# Altium schematic sheet ESC.SchDoc (part 3 of 3)

# Altium schematic sheet ESC.SchDoc (continued)
size A2; SheetNumber (continued): <Dependency>0\outputcir_iscdiodeideal</Dependency> / <Dependency>0\dallasamp_outputcir_voh_ht4</Dependency> / <Dependency>0\dallasamp_outputcir_isinkvlimit_ht4</Dependency> / <Dependency>0\dallasamp_outputcir_vol_ht4</Dependency> / <Dependency>0\dallasamp_outputcir_rout_ht4</Dependency> / <Dependency>0\dallasamp_diodeideal_ht4</Dependency> / <Dependency>0\dallasamp_outputcir_iload_ht4</Dependency> / <Dependency>0\analog_buffer</Dependency> / <Dependency>0\dallasamp_outputcir_recoveryassist_ht4</Dependency> / <Dependency>0\hpa_or2</Dependency> / <Dependency>0\hpa_comp_ideal</Dependency> / </Model> / <Model Name="dallasamp_nondompole_ht4" Kind="CKT"> / <Text>.subckt DALLASAMP_NONDOMPOLE_HT4 VIN VOUT / XI23 NET4 VIN ANALOG_BUFFER / C1 VOUT 0 1.035E-12 / R1 VOUT NET4 1 / .ends DALLASAMP_NONDOMPOLE_HT4</Text> / <Dependency>0\analog_buffer</Dependency> / </Model> / <Model Name="dallasamp_vinrange_ht4" Kind="CKT"> / <Text>.subckt DALLASAMP_VINRANGE_HT4 VCC VEE VIN VOUT / XIDVIH NET12 NET16 DallasAmp_DiodeIdeal_HT4 / XIDVIL NET16 NET20 DallasAmp_DiodeIdeal_HT4 / R0 VIN NET16 1e-3 / V0 NET16 VOUT 0 / VIL NET20 VEE -150e-03 / VIH VCC NET12 150e-03 / .ends DALLASAMP_VINRANGE_HT4</Text> / <Dependency>0\dallasamp_diodeideal_ht4</Dependency> / </Model> / <Model Name="dallasamp_dompole_ht4" Kind="CKT"> / <Text>.subckt DALLASAMP_DOMPOLE_HT4 A B / R0 B A 6.403E04 / C0 A B 9.26E-10 / .ends DALLASAMP_DOMPOLE_HT4</Text> / </Model> / <Model Name="dallasamp_recoverycircuit_ht4" Kind="CKT"> / <Text>.subckt DALLASAMP_RECOVERYCIRCUIT_HT4 A B VCC VEE / XI2 NET8 NET014 DallasAmp_DiodeIdeal_HT4 / XI3 NET014 NET9 DallasAmp_DiodeIdeal_HT4 / VBRIDGE NET014 A 0 / VPROBE A B 0 / VRECL NET9 VEE -10e-3 / VRECH VCC NET8 -10e-3 / .ends DALLASAMP_RECOVERYCIRCUIT_HT4</Text> / <Dependency>0\dallasamp_diodeideal_ht4</Dependency> / </Model> / <Model Name="dallasamp_iq_ht4" Kind="CKT"> / <Text>.subckt DallasAmp_Iq_HT4 VCCmain VEEmain PD VEE VCC / .PARAM IOFF = { 1n } / .PARAM ION_X1 = { 0.0 } / .PARAM ION_Y1 = { 1m } / .PARAM ION_X2 = { 1.6 } / .PARAM ION_Y2 = { 1m } / .PARAM ION_X3 = { 4.0 } / .PARAM ION_Y3 = { 1m } / .PARAM ION_X4 = { 6.0 } / .PARAM ION_Y4 = { 1m } / EION_SEG1 ION_SEG1 0 VALUE = { IF ( 		          V(VCC,VEE) &lt;= ION_X2, 1, 0 ) } / EION_SEG2 ION_SEG2 0 VALUE = { IF ( V(VCC,VEE) &gt; ION_X2 &amp; V(VCC,VEE) &lt;= ION_X3, 1, 0 ) } / EION_SEG3 ION_SEG3 0 VALUE = { IF ( V(VCC,VEE) &gt; ION_X3		              , 1, 0 ) } / .PARAM ION_SEG1_SLOPE = { ( ION_Y2 - ION_Y1 ) / ( ION_X2 - ION_X1 ) } / .PARAM ION_SEG1_INTCP = { ION_Y1 - ION_SEG1_SLOPE * ION_X1 } / .PARAM ION_SEG2_SLOPE = { ( ION_Y3 - ION_Y2 ) / ( ION_X3 - ION_X2 ) } / .PARAM ION_SEG2_INTCP = { ION_Y2 - ION_SEG2_SLOPE * ION_X2 } / .PARAM ION_SEG3_SLOPE = { ( ION_Y4 - ION_Y3 ) / ( ION_X4 - ION_X3 ) } / .PARAM ION_SEG3_INTCP = { ION_Y3 - ION_SEG3_SLOPE * ION_X3 } / EION ION 0 VALUE = { 	V(ION_SEG1) * ( ION_SEG1_SLOPE * V(VCC,VEE) + ION_SEG1_INTCP ) + / +			V(ION_SEG2) * ( ION_SEG2_SLOPE * V(VCC,VEE) + ION_SEG2_INTCP ) + / + 			V(ION_SEG3) * ( ION_SEG3_SLOPE * V(VCC,VEE) + ION_SEG3_INTCP ) 	} / X1 PD PDINV VCC VEE LOGIC1 0 DLSINV / VLOGIC1 LOGIC1 0 1 / G1 VCCMAIN VEEMAIN VALUE = { V(ION) * ( 1-V(PDINV) ) + IOFF * V(PDINV) } / .ends</Text> / <Dependency>0\dlsinv</Dependency> / </Model> / <Model Name="dallasamp_zin_ht4" Kind="CKT"> / <Text>.subckt DALLASAMP_ZIN_HT4 IN1 IN2 OUT1 OUT2 / R5 IN2 OUT2 100e-3 / R4 IN1 OUT1 100e-3 / C3 OUT1 OUT2 50e-15 / C2 OUT2 0 50e-15 / C1 OUT1 0 50e-15 / GR2 OUT2 0 OUT2 0 100e-12 / GR1 0 OUT1 0 OUT1 100e-12 / GR3 OUT1 OUT2 OUT1 OUT2 1e-9 / .ends DALLASAMP_ZIN_HT4</Text> / </Model> / <Model Name="dallasamp_gmitail_ht4" Kind="CKT"> / <Text>.SUBCKT DallasAmp_GmItail_HT4  Vinp Vinm Ioutp Ioutm VEE VCC PD / X1 PD PDINV VCC VEE LOGIC1 0 DLSINV / VLOGIC1 LOGIC1 0 1 / .PARAM ITAILMAX_X1 = { 3.0 } / .PARAM ITAILMAX_Y1 = { 10m } / .PARAM ITAILMAX_X2 = { 6.0 } / .PARAM ITAILMAX_Y2 = { 10m } / .PARAM ITAILMAX_SLOPE = / + { ( ITAILMAX_Y2 - ITAILMAX_Y1 ) / ( ITAILMAX_X2 - ITAILMAX_X1 ) } / .PARAM ITAILMAX_INTCP = / + { ITAILMAX_Y1 - ITAILMAX_SLOPE * ITAILMAX_X1 } / EITAILMAX ITAILMAX 0 VALUE = / + { ITAILMAX_SLOPE * V(VCC,VEE) + ITAILMAX_INTCP  } / .PARAM ITAILMIN_X1 = { 3.0 } / .PARAM ITAILMIN_Y1 = { 10m } / .PARAM ITAILMIN_X2 = { 6.0 } / .PARAM ITAILMIN_Y2 = { 10m } / .PARAM ITAILMIN_SLOPE = / + { ( ITAILMIN_Y2 - ITAILMIN_Y1 ) / ( ITAILMIN_X2 - ITAILMIN_X1 ) } / .PARAM ITAILMIN_INTCP = / + { ITAILMIN_Y1 - ITAILMIN_SLOPE * ITAILMIN_X1 } / EITAILMIN ITAILMIN 0 VALUE = / + { ITAILMIN_SLOPE * V(VCC,VEE) + ITAILMIN_INTCP  } / G1 IOUTP IOUTM VALUE = { LIMIT ( 1.562e-01 * V(VINP,VINM) * ( 1-V(PDINV) ) , -V(ITAILMIN), / + V(ITAILMAX) ) } / .ENDS</Text> / <Dependency>0\dlsinv</Dependency> / </Model> / <Model Name="hpa_inv_ideal" Kind="CKT"> / <Text>.SUBCKT HPA_INV_IDEAL 1 2 VDD VSS / E1 2 0 VALUE = { IF( V(1)&gt; (V(VDD)+V(VSS))/2, V(VSS), V(VDD) ) } / .ENDS</Text> / </Model> / <Model Name="cmrr_new" Kind="CKT"> / <Text>.SUBCKT CMRR_NEW   VI  VO VX GNDF PARAMS: CMRR = 130 FCMRR = 1.6K / .PARAM PI = 3.141592 / .PARAM RCMRR = 1 / .PARAM GCMRR = {PWR(10,-CMRR/20)/RCMRR} / .PARAM LCMRR = {RCMRR/(2*PI*FCMRR)} / G1  GNDF 1 VX GNDF {GCMRR} / R1  1 2 {RCMRR} / L1  2 GNDF {LCMRR} / EA  101 GNDF 1 GNDF 1 / GRA  101 102 VALUE = {V(101,102)/1e6} / CA  102 GNDF 1e3 / EB  1 1a VALUE = {V(102,GNDF)} / E1  VI VO 1a GNDF 1 / .ENDS</Text> / </Model> / <Model Name="dallasamp_cmrr_ht4" Kind="CKT"> / <Text>.SUBCKT DallasAmp_CMRR_HT4 A B C / .PARAM CMRR_DC 	             = -86 / .PARAM CMRR_f3dB             = 10e3 / .PARAM CMRR_f3dB_FudgeFactor = 1 / *.PARAM CMRR_f3dB_FudgeFactor = 3.4 / .PARAM CMRR       = {0-CMRR_DC} / .PARAM FCMRR	  = {CMRR_f3dB * CMRR_f3dB_FudgeFactor} / X1 A B C 0 CMRR_NEW PARAMS: CMRR = {CMRR} FCMRR = {FCMRR} / .ENDS</Text> / <Dependency>0\cmrr_new</Dependency> / </Model> / <Model Name="psrr_dual_new" Kind="CKT"> / <Text>.SUBCKT PSRR_DUAL_NEW   VDD  VSS  VI  VO  GNDF / + PARAMS: PSRRP = 130 FPSRRP = 1.6 / + PSRRN = 130 FPSRRN = 1.6 / .PARAM PI = 3.141592 / .PARAM RPSRRP = 1 / .PARAM GPSRRP = {PWR(10,-PSRRP/20)/RPSRRP} / .PARAM LPSRRP = {RPSRRP/(2*PI*FPSRRP)} / .PARAM RPSRRN = 1 / .PARAM GPSRRN = {PWR(10,-PSRRN/20)/RPSRRN} / .PARAM LPSRRN = {RPSRRN/(2*PI*FPSRRN)} / G1  GNDF 1 VDD GNDF {GPSRRP} / R1  1 2 {RPSRRP} / L1  2 GNDF {LPSRRP} / EA  101 GNDF 1 GNDF 1 / GRA  101 102 VALUE = { V(101,102)/1e6 } / CA  102 GNDF 1e3 / EB  1 1a VALUE = {V(102,GNDF)} / G2  GNDF 3 VSS GNDF {GPSRRN} / R2  3 4 {RPSRRN} / L2  4 GNDF {LPSRRN} / EC  301 GNDF 3 GNDF 1 / GRC  301 302 VALUE = { V(301,302)/1e6 } / CC  302 GNDF 1e3 / ED  3 3a VALUE = {V(302,GNDF)} / E1  VO VI VALUE = {V(1a,GNDF) + V(3a,GNDF)} / C3  VDD VSS 10P / .ENDS</Text> / </Model> / <Model Name="dallasamp_psrr_ht4" Kind="CKT"> / <Text>.SUBCKT DallasAmp_PSRR_HT4 VDD VSS A B / .PARAM PSRRP_DC    = -100 / .PARAM PSRRP_f3dB  = 100k / .PARAM PSRRN_DC    = -90 / .PARAM PSRRN_f3dB  = 90k / .PARAM PSRRP       = {0-PSRRP_DC} / .PARAM PSRRN       = {0-PSRRN_DC} / .PARAM FPSRRP      = {PSRRP_f3dB} / .PARAM FPSRRN      = {PSRRN_f3dB} / X1 VDD VSS A B 0 PSRR_DUAL_NEW PARAMS: / + PSRRP = {PSRRP} FPSRRP = {FPSRRP} / + PSRRN = {PSRRN} FPSRRN = {FPSRRN} / .ENDS</Text> / <Dependency>0\psrr_dual_new</Dependency> / </Model> / <Model Name="femt" Kind="CKT"> / <Text>.SUBCKT FEMT  1 2 PARAMS: NLFF = 0.1 FLWF = 0.001 NVRF = 0.1 / .PARAM GLFF={PWR(FLWF,0.25)*NLFF/1164} / .PARAM RNVF={1.184*PWR(NVRF,2)} / .MODEL DVNF D KF={PWR(FLWF,0.5)/1E11} IS=1.0E-16 / I1 0 7 10E-3 / I2 0 8 10E-3 / D1 7 0 DVNF / D2 8 0 DVNF / E1 3 6 7 8 {GLFF} / R1 3 0 1E9 / R2 3 0 1E9 / R3 3 6 1E9 / E2 6 4 5 0 10 / R4 5 0 {RNVF} / R5 5 0 {RNVF} / R6 3 4 1E9 / R7 4 0 1E9 / G1 1 2 3 4 1E-6 / C1 1 0 1E-15 / C2 2 0 1E-15 / C3 1 2 1E-15 / .ENDS</Text> / </Model> / <Model Name="dallasamp_inoise_ht4" Kind="CKT"> / <Text>.SUBCKT DallasAmp_Inoise_HT4 A B / .PARAM X = { 1m  } / .PARAM Y = { 100 } / .PARAM Z = { 1 } / X1 A B FEMT PARAMS: NLFF = { Y }  FLWF = { X } NVRF = { Z } / .ENDS</Text> / <Dependency>0\femt</Dependency> / </Model> / <Model Name="vnse" Kind="CKT"> / <Text>.SUBCKT VNSE  1 2 PARAMS: NLF = 10 FLW = 4  NVR = 4.6 / .PARAM GLF={PWR(FLW,0.25)*NLF/1164} / .PARAM RNV={1.184*PWR(NVR,2)} / .MODEL DVN D KF={PWR(FLW,0.5)/1E11} IS=1.0E-16 / I1 0 7 10E-3 / I2 0 8 10E-3 / D1 7 0 DVN / D2 8 0 DVN / E1 3 6 7 8 {GLF} / R1 3 0 1E9 / R2 3 0 1E9 / R3 3 6 1E9 / E2 6 4 5 0 10 / R4 5 0 {RNV} / R5 5 0 {RNV} / R6 3 4 1E9 / R7 4 0 1E9 / E3 1 2 3 4 1 / C1 1 0 1E-15 / C2 2 0 1E-15 / C3 1 2 1E-15 / .ENDS</Text> / </Model> / <Model Name="dallasamp_vnoise_ht4" Kind="CKT"> / <Text>.SUBCKT DallasAmp_Vnoise_HT4 A B / .PARAM X = { 1m  } / .PARAM Y = { 100 } / .PARAM Z = { 5  } / X1 A B VNSE PARAMS: NLF = { Y } FLW = { X }  NVR = { Z } / .ENDS</Text> / <Dependency>0\vnse</Dependency> / </Model> / <Model Name="vinoffset" Kind="CKT"> / <Text>.SUBCKT Vinoffset POS NEG PARAMS: / + TA     = 25 / + VOS    = 500u / + DRIFT  = 10u / E1 POS NEG VALUE = { DRIFT * TEMP + ( VOS - DRIFT * TA ) } / .ENDS</Text> / </Model> / <Model Name="dallasamp_ht4" Kind="CKT"> / <Text>.subckt DALLASAMP_HT4 VEE VCC VINM VINP VOUT PD / XI13 VEE_INT VEE ANALOG_BUFFER / XI12 VCC_INT VCC ANALOG_BUFFER / XI58 HIGHZ NET32 DALLASAMP_DOMPOLE_HT4 / XI28 NET41 NET51 VCC_INT VEE_INT DALLASAMP_RECOVERYCIRCUIT_HT4 / XI26 NET51 NET61 DALLASAMP_NONDOMPOLE_HT4 / XI30 POWER VCC_INT VCC VEE_INT VEE NET61 VOUT DALLASAMP_OUTPUTCIR_HT4 / IBIASP VINP_INT 0 100.5e-6 / IBIASM VINM_INT 0 99.5e-6 / XI56 VCC_INT VEE_INT NET22 VINM_INT DALLASAMP_VINRANGE_HT4 / XI54 VCC_INT VEE_INT NET21 VINP_INT DALLASAMP_VINRANGE_HT4 / XI53 VINP VINM NET1 NET2 DALLASAMP_ZIN_HT4 / XI40 VCC VEE POWER VEE_INT VCC_INT DallasAmp_Iq_HT4 / XI52 VINP_INT VINM_INT NET32 NET31 VEE_INT VCC_INT POWER DallasAmp_GmItail_HT4 / XAHDLINV3 PD PDINV VCC_INT VEE_INT HPA_INV_IDEAL / XAHDLINV1 PDINV POWER VCC_INT VEE_INT HPA_INV_IDEAL / XI21 NET12 NET22 NET12 DallasAmp_CMRR_HT4 / XI19 VCC_INT VEE_INT NET2 NET12 DallasAmp_PSRR_HT4 / XI18 NET11 NET2 DallasAmp_Inoise_HT4 / XI17 NET1 NET11 DallasAmp_Vnoise_HT4 / R14 VCC_INT PD 10e6 / *VINOFFSET NET21 NET11 4.00e-03 / XVINOFFSET NET21 NET11 Vinoffset PARAMS: TA=25 VOS=4.00e-03 DRIFT=10e-6 / VPROBE1 NET31 HIGHZ / VDOMPOLEBIAS NET32 0 0 / VPROBE2 HIGHZ NET41 / .ends DALLASAMP_HT4</Text> / <Dependency>0\dallasamp_outputcir_ht4</Dependency> / <Dependency>0\dallasamp_nondompole_ht4</Dependency> / <Dependency>0\analog_buffer</Dependency> / <Dependency>0\dallasamp_vinrange_ht4</Dependency> / <Dependency>0\dallasamp_dompole_ht4</Dependency> / <Dependency>0\dallasamp_recoverycircuit_ht4</Dependency> / <Dependency>0\dallasamp_iq_ht4</Dependency> / <Dependency>0\dallasamp_zin_ht4</Dependency> / <Dependency>0\dallasamp_gmitail_ht4</Dependency> / <Dependency>0\hpa_inv_ideal</Dependency> / <Dependency>0\dallasamp_cmrr_ht4</Dependency> / <Dependency>0\dallasamp_psrr_ht4</Dependency> / <Dependency>0\dallasamp_inoise_ht4</Dependency> / <Dependency>0\dallasamp_vnoise_ht4</Dependency> / <Dependency>0\vinoffset</Dependency> / </Model> / <Model Name="drv8301" Kind="CKT"> / <Text>.subckt DRV8301 AGND AVDD VINM VINP VOUT / XI0 AGND AVDD VINM VINP VOUT PD DALLASAMP_HT4 / VPD AVDD PD 0 / .ends DRV8301</Text> / <Dependency>0\dallasamp_ht4</Dependency> / </Model> / </CacheFrame> / <CacheFrame Number="1"> / <Model Name="and2_basic_gen" Kind="CKT"> / <Text>*$ / .SUBCKT AND2_BASIC_GEN A B Y PARAMS: VDD=1 VSS=0 VTHRESH=0.5 / $CDNENCSTART_ADV2 / 17f62b1fb318c25603aeb85644ae98a5d179ef807807791f6459efacb9d7ffc37a831b146dc0f06bb1ef275619162e6d8f7ad0dc708bf15ae1a1d5bd0ae623b2 / 86cf27ea17897a8cb60df20d05c273fb463c60c76d6334b75e98d0c9903dbd1ecfc0e08f63319350a0d2430850129986dff8dba9cdb764afe6b55a7105d51a71 / 0242b14f7642c07a6d9287a63f6461352391fe406c6a9c4085f8c2cbc54e9cb41d6c66e497028004a07d0f821750426c9d08104ef29d51d519a2f240b668e378 / 0b1b023dc81c8cdaa7d8f234b53a8b39ea1af96ea6d6f635f68326cabbe00c0582efc3103447d6c6b2120f40908dbf452c257e0a60c0cb32dcc1fc097092974a / f4a0ccfc221f4350afb7bd0e1ee5b3e3b70c4285467156eeef951a190d9667302310153a23532af982540dd23c06ecb988541f163696fafdd3b10b26b5350bb0 / $CDNENCFINISH_ADV2 / .ENDS AND2_BASIC_GEN</Text> / </Model> / <Model Name="comphys_basic_gen" Kind="CKT"> / <Text>*$ / .SUBCKT COMPHYS_BASIC_GEN INP INM HYS OUT PARAMS: VDD=1 VSS=0 VTHRESH=0.5 / $CDNENCSTART_ADV2 / 17f62b1fb318c25603aeb85644ae98a5d179ef807807791f6459efacb9d7ffc37a831b146dc0f06bb1ef275619162e6d8f7ad0dc708bf15ae1a1d5bd0ae623b2 / 00b53bbe8aae8852330f25271bb63ecb452f6be533f052ee67be30628730681a13f044dd88b365416669eca870fc8051764ee52247de91cdf5aa26f485295593 / 3e3f3e87086a35502de552f1ad36fdf5bf8222e25b990f2da798a9a0a112ff9bb92ed6f3db7fa99fa26abaf945e35c2d412b761f12c297f5efc8392584f55ebe / 454a7b940f4bb638243842aeebba109a8e2e962c97ddc20b67358915b778ac64130ecf4cc706742a6f2e1f35c49e2d86f67a62546841f85d99530ec55b3108f8 / 618bf9559b884c783dff91d3e2bf7ec8c31bf63f60850221a7ac1e46b19d611a14ce99fe5fc488c292605a68529c58a741df5705408475625a9630c1a16a85bd / b20ca1c170870dc7dae626dcd13a6492ba4a2336c155842202ef4231ea29571c6165ae46f7df2f50aa28a839a9663dcf612ed07829bc9d7912fd290065bfc094 / 2f77ff083073b88efd1f7f431862ebf4563efeb4711097ae753a42feaed9de84876afd92a80bee00a2113155d96b93d68848804a173641721f71a1af57dd2c20 / $CDNENCFINISH_ADV2 / .ENDS COMPHYS_BASIC_GEN</Text> / </Model> / <Model Name="inv_basic_gen" Kind="CKT"> / <Text>.SUBCKT INV_BASIC_GEN A  Y PARAMS: VDD=1 VSS=0 VTHRESH=0.5 / $CDNENCSTART_ADV2 / 17f62b1fb318c25603aeb85644ae98a5d179ef807807791f6459efacb9d7ffc37a831b146dc0f06bb1ef275619162e6d8f7ad0dc708bf15ae1a1d5bd0ae623b2 / 86cf27ea17897a8cb60df20d05c273fb463c60c76d6334b75e98d0c9903dbd1ecfc0e08f63319350a0d2430850129986b9dbfa59b51add982529e38ae20cb170 / 17aa90e4a67664d4f9eaeca2cb7e984d1b42e2318efa134cf42b00e9e24fcdd0cdddf84886c0fd8c2a5c0e1b2ba152f34969c107ff1b81b484f51bbed89c9c89 / 0b1b023dc81c8cdaa7d8f234b53a8b39ea1af96ea6d6f635f68326cabbe00c0582efc3103447d6c6b2120f40908dbf452c257e0a60c0cb32dcc1fc097092974a / f4a0ccfc221f4350afb7bd0e1ee5b3e3b70c4285467156eeef951a190d9667302310153a23532af982540dd23c06ecb988541f163696fafdd3b10b26b5350bb0 / $CDNENCFINISH_ADV2 / .ENDS INV_BASIC_GEN</Text> / </Model> / </CacheFrame> / </root>
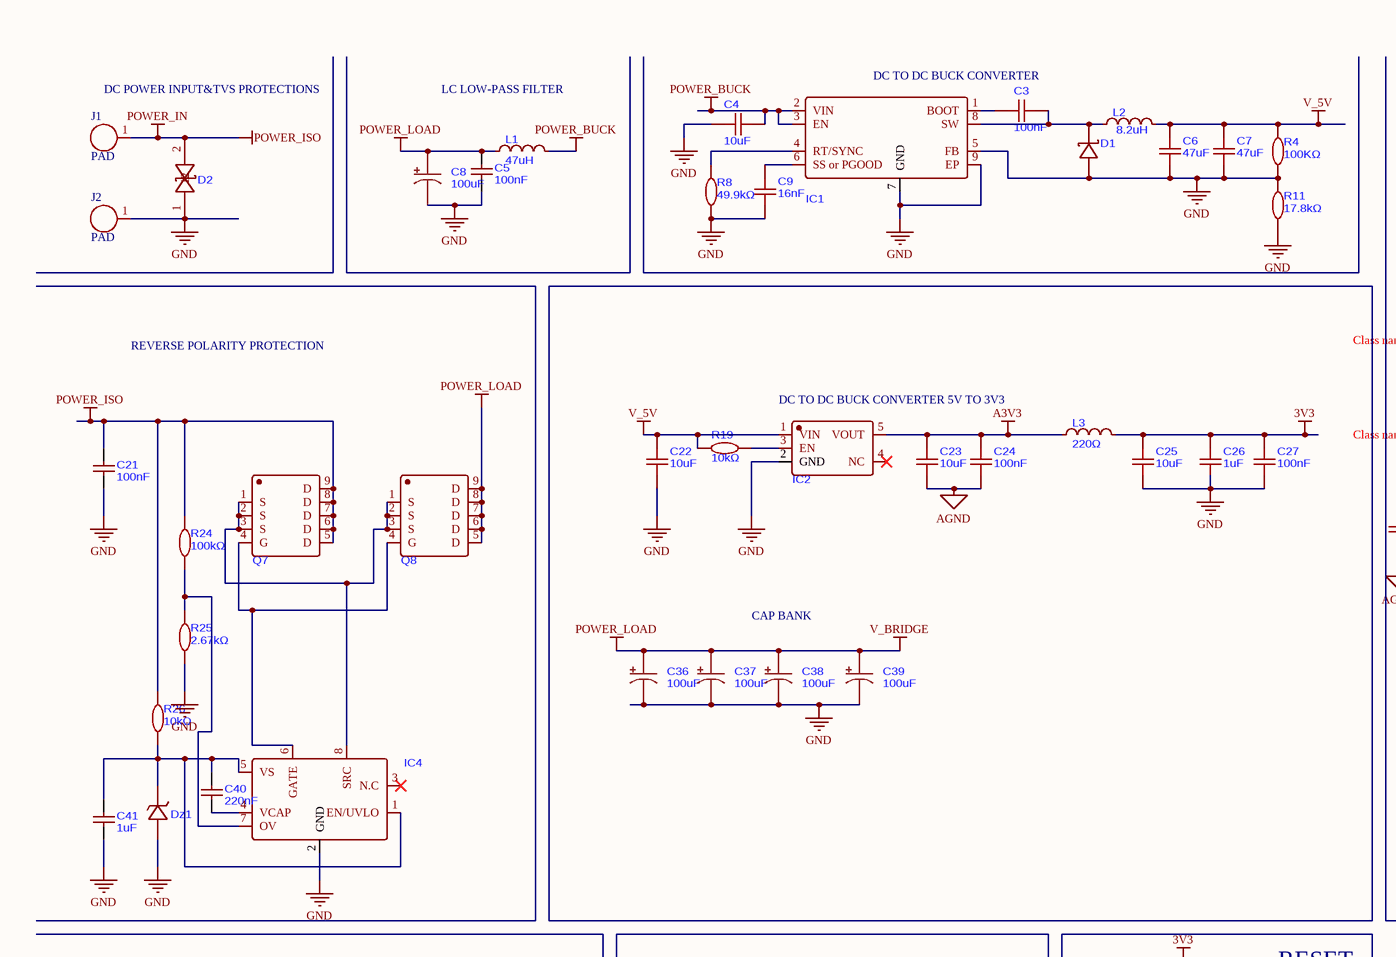
[diagram p0: ESC.SchDoc, top left]
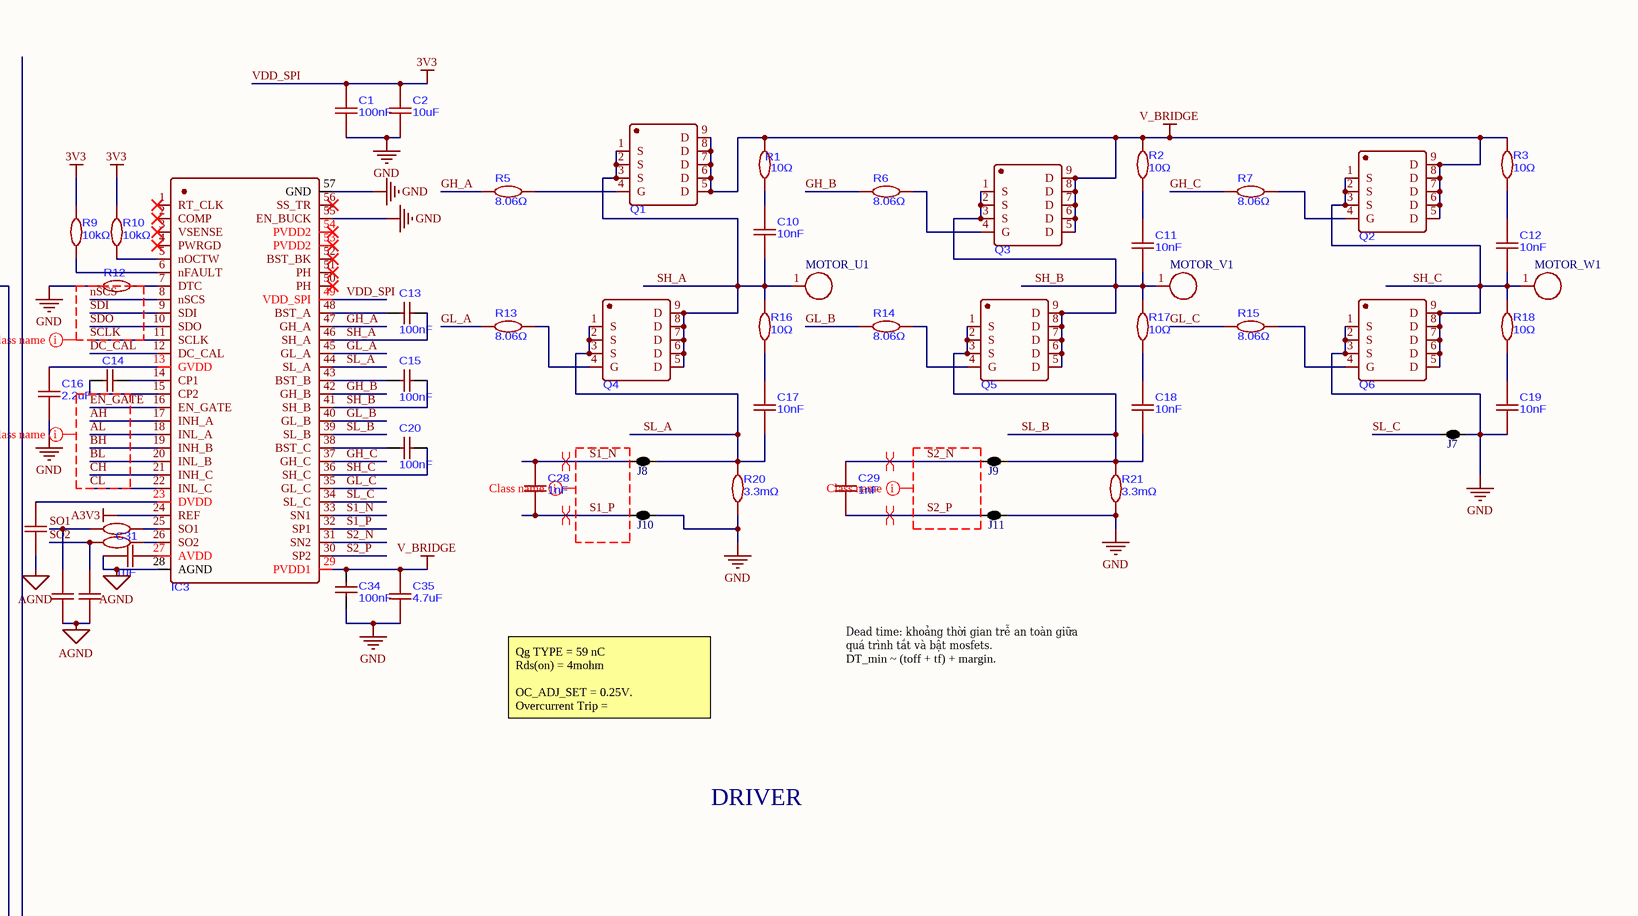
[diagram p1: ESC.SchDoc, top right]
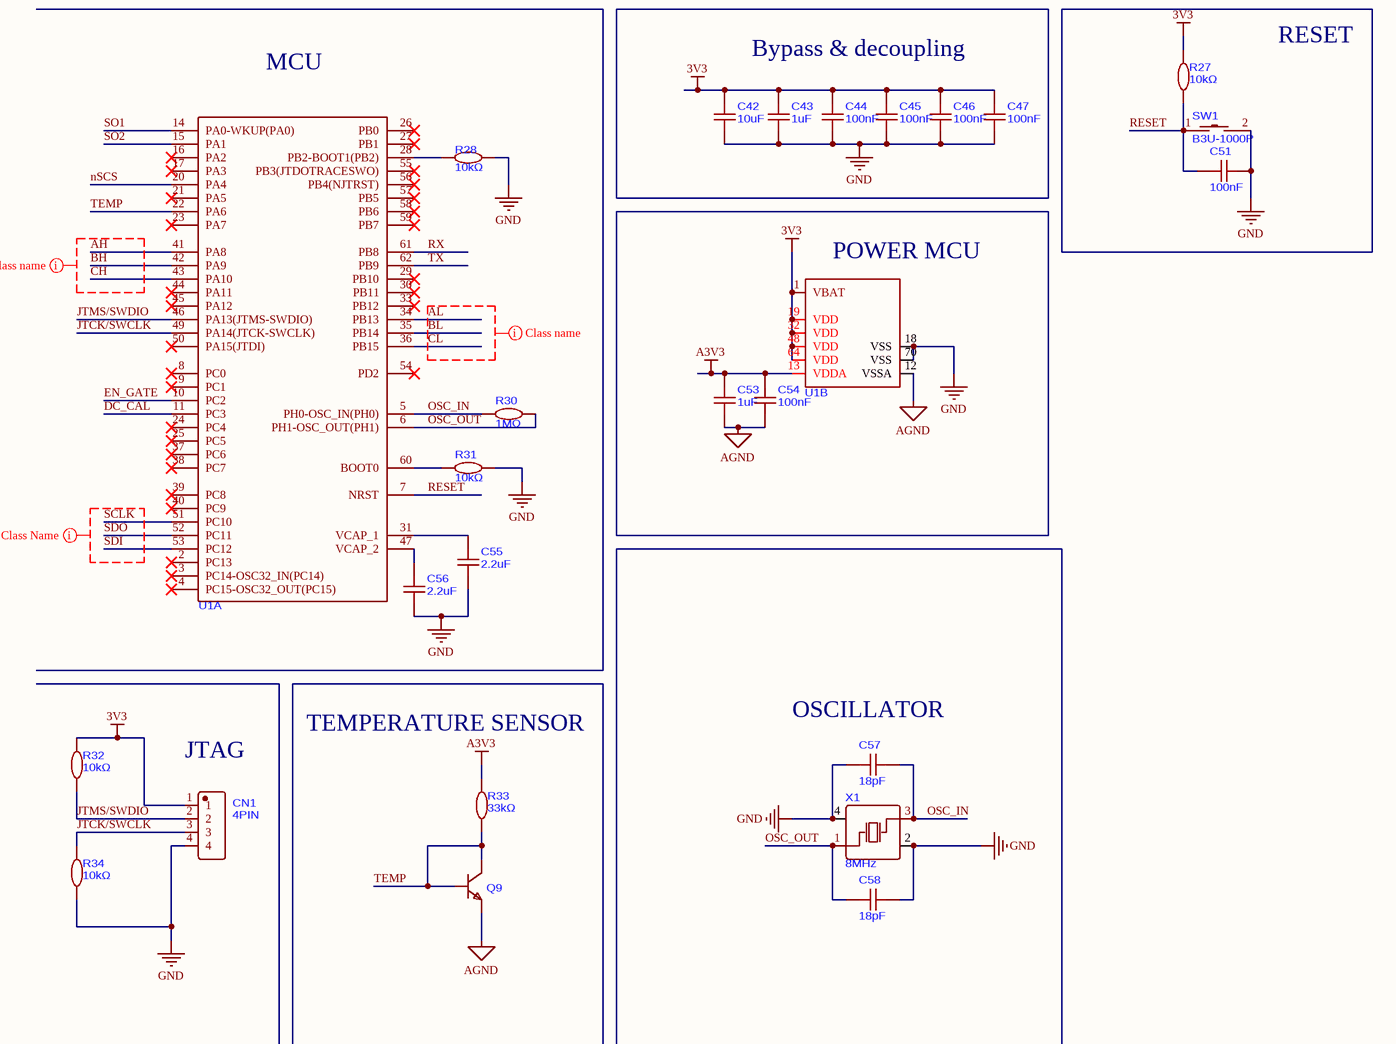
[diagram p2: ESC.SchDoc, bottom left]
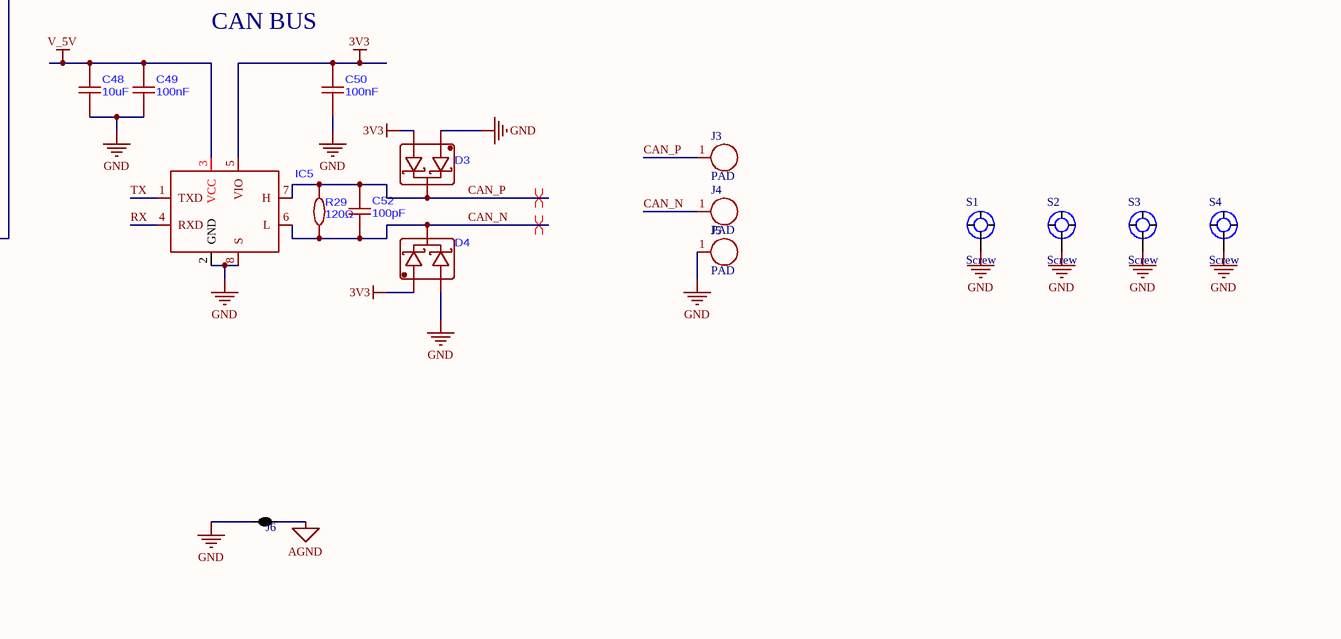
[diagram p3: ESC.SchDoc, bottom right]

## Parts
C1  100nF  [C0603]
C2  10uF  [C0603]
C3  100nF  [C0603]
C4  10uF  [C1206]
C5  100nF  [C0805]
C6  47uF  [C0603]
C7  47uF  [C0603]
C8  100uF  [CAP-SMD_BD10.0-L10.3-W10.3-FD]
C9  16nF  [C1206]
C10  10nF  [C0805]
C11  10nF  [C0805]
C12  10nF  [C0805]
C13  100nF  [C0805]
C14  220nF  [C0805]  (value not drawn)
C15  100nF  [C0805]
C16  2.2uF  [C0603]
C17  10nF  [C0805]
C18  10nF  [C0805]
C19  10nF  [C0805]
C20  100nF  [C0805]
C21  100nF  [C0805]
C22  10uF  [C0603]
C23  10uF  [C0603]
C24  100nF  [C0603]
C25  10uF  [C0603]
C26  1uF  [C0603]
C27  100nF  [C0603]
C28  1nF  [C0603]
C29  1nF  [C0603]
C30  1uF  [C0603]  (value not drawn)
C31  1uF  [C0603]
C32  2.2uF  [C0603]  (value not drawn)
C33  2.2uF  [C0603]  (value not drawn)
C34  100nF  [C0805]
C35  4.7uF  [C0805]
C36  100uF  [CAP-SMD_BD10.0-L10.3-W10.3-FD]
C37  100uF  [CAP-SMD_BD10.0-L10.3-W10.3-FD]
C38  100uF  [CAP-SMD_BD10.0-L10.3-W10.3-FD]
C39  100uF  [CAP-SMD_BD10.0-L10.3-W10.3-FD]
C40  220nF  [C0603]
C41  1uF  [C0603]
C42  10uF  [C0603]
C43  1uF  [C0603]
C44  100nF  [C0603]
C45  100nF  [C0603]
C46  100nF  [C0603]
C47  100nF  [C0603]
C48  10uF  [C0603]
C49  100nF  [C0603]
C50  100nF  [C0603]
C51  100nF  [C0603]
C52  100pF  [C0603]
C53  1uF  [C0603]
C54  100nF  [C0603]
C55  2.2uF  [C0603]
C56  2.2uF  [C0603]
C57  18pF  [C0603]
C58  18pF  [C0603]
CN1  4PIN  [HDR-TH_4P-HX-PH254-01-04-Z-L11.5]
D1  DIODE SCHOTTKY 100V DO-214AB  [SMC_L7.1-W6.2-LS8.1-RD]  (value not drawn)
D2  TVS DIODE 54VWM 87.1VC DO-214AB(SMCJ)  [SMB_L4.6-W3.6-LS5.3-BI]  (value not drawn)
D3  DIODE ARR SCHOTTKY 30V SOT-23  [SOT-23-3_L2.9-W1.3-P1.90-LS2.4-BR]  (value not drawn)
D4  DIODE ARR SCHOTTKY 30V SOT-23  [SOT-23-3_L2.9-W1.3-P1.90-LS2.4-BR]  (value not drawn)
Dz1  DIODE ZENER 56V 500mW SOD-123W  [SOD-123_L2.8-W1.8-LS3.7-RD]  (value not drawn)
IC1  60V 3A Step-Down Converter  [SOIC-8_L4.9-W3.9-P1.27-LS6.0-BL-EP2.3]  (value not drawn)
IC2  500mA Low-Noise LDo Voltage Regulator  [SOT-23-5_L2.9-W1.6-P0.95-LS2.8-BR]  (value not drawn)
IC3  DRV8301 Three-Phase Gate Driver With Dual Current Shunt Amplifiers and Buck Regulator  [HTSSOP-56_L14.0-W6.0-P0.50-LS8.1-BL-EP]  (value not drawn)
IC4  TSOT-23-8 OR Controllers, Ideal Diodes RoHS  [SOT-23-8_L2.9-W1.6-P0.65-LS2.8-BL]  (value not drawn)
IC5  High-speed CAN transceiver  [SOIC-8_L4.9-W3.9-P1.27-LS6.0-BL]  (value not drawn)
J1  PAD  [PAD]
J2  PAD  [PAD]
J3  PAD  [PAD]
J4  PAD  [PAD]
J5  PAD  [PAD]
J6  2 way net tie junction  [2way_HP]  (value not drawn)  (net tie, no BOM)
J7  2 way net tie junction  [2way_LP]  (value not drawn)  (net tie, no BOM)
J8  2 way net tie junction  [2way_LP]  (value not drawn)  (net tie, no BOM)
J9  2 way net tie junction  [2way_LP]  (value not drawn)  (net tie, no BOM)
J10  2 way net tie junction  [2way_LP]  (value not drawn)  (net tie, no BOM)
J11  2 way net tie junction  [2way_LP]  (value not drawn)  (net tie, no BOM)
L1  47uH  [IND-SMD_L12.3-W12.3]
L2  8.2uH  [IND-SMD_L7.0-W6.6_FXL0630]
L3  220Ω  [C0805]
MOTOR_U1  PAD  [PAD]  (value not drawn)
MOTOR_V1  PAD  [PAD]  (value not drawn)
MOTOR_W1  PAD  [PAD]  (value not drawn)
Q1  MOSFET N-CH 80V 100A SOP-8-Advance  [SOP-8_L5.0-W5.0-P1.27-LS6.0_TPH4R008NH-L1Q]  (value not drawn)
Q2  MOSFET N-CH 80V 100A SOP-8-Advance  [SOP-8_L5.0-W5.0-P1.27-LS6.0_TPH4R008NH-L1Q]  (value not drawn)
Q3  MOSFET N-CH 80V 100A SOP-8-Advance  [SOP-8_L5.0-W5.0-P1.27-LS6.0_TPH4R008NH-L1Q]  (value not drawn)
Q4  MOSFET N-CH 80V 100A SOP-8-Advance  [SOP-8_L5.0-W5.0-P1.27-LS6.0_TPH4R008NH-L1Q]  (value not drawn)
Q5  MOSFET N-CH 80V 100A SOP-8-Advance  [SOP-8_L5.0-W5.0-P1.27-LS6.0_TPH4R008NH-L1Q]  (value not drawn)
Q6  MOSFET N-CH 80V 100A SOP-8-Advance  [SOP-8_L5.0-W5.0-P1.27-LS6.0_TPH4R008NH-L1Q]  (value not drawn)
Q7  MOSFET N-CH 80V 100A SOP-8-Advance  [SOP-8_L5.0-W5.0-P1.27-LS6.0_TPH4R008NH-L1Q]  (value not drawn)
Q8  MOSFET N-CH 80V 100A SOP-8-Advance  [SOP-8_L5.0-W5.0-P1.27-LS6.0_TPH4R008NH-L1Q]  (value not drawn)
Q9  TRANS NPN 40V 200mA SOT-416  [SC-75-3_L1.6-W0.8-P1.00-LS1.6-BR]  (value not drawn)
R1  10Ω  [R0805]
R2  10Ω  [R0805]
R3  10Ω  [R0805]
R4  100KΩ  [R0603]
R5  8.06Ω  [R1206]
R6  8.06Ω  [R1206]
R7  8.06Ω  [R1206]
R8  49.9kΩ  [R0603]
R9  10kΩ  [R0603]
R10  10kΩ  [R0603]
R11  17.8kΩ  [R0603]
R12  24.9KΩ  [R0603]  (value not drawn)
R13  8.06Ω  [R1206]
R14  8.06Ω  [R1206]
R15  8.06Ω  [R1206]
R16  10Ω  [R0805]
R17  10Ω  [R0805]
R18  10Ω  [R0805]
R19  10kΩ  [R0603]
R20  3.3mΩ  [R2512]
R21  3.3mΩ  [R2512]
R22  56Ω  [R0603]  (value not drawn)
R23  56Ω  [R0603]  (value not drawn)
R24  100kΩ  [R0603]
R25  2.67kΩ  [R0603]
R26  10kΩ  [R0603]
R27  10kΩ  [R0603]
R28  10kΩ  [R0603]
R29  120Ω  [R0603]
R30  1MΩ  [R0603]
R31  10kΩ  [R0603]
R32  10kΩ  [R0603]
R33  33kΩ  [R0603]
R34  10kΩ  [R0603]
S1  Screw  [Screw Hole 4mm]
S2  Screw  [Screw Hole 4mm]
S3  Screw  [Screw Hole 4mm]
S4  Screw  [Screw Hole 4mm]
SW1  B3U-1000P  [KEY-SMD_B3U-1000PM]
U1  ARM Cortex-M4 32b MCU+FPU, 210DMIPS, up to 1MB Flash/192+4KB RAM, USB OTG HS/FS, Ethernet, 17 TIMs, 3 ADCs, 15 comm. interfaces & camera  [LQFP-64_L10.0-W10.0-P0.50-LS12.0-BL]  (value not drawn)  (parts A,B of 2)
X1  8MHz  [OSC-SMD_4P-L5.0-W3.2-BL]

## Nets
A3V3: C23.2 C24.2 C53.2 C54.2 IC2.5(VOUT) IC3.24(REF) L3.1 R33.2 U1.13(VDDA)
AGND: C23.1 C24.1 C30.1 C31.2 C32.1 C33.1 C53.1 C54.1 IC3.28(AGND) J6.2 Q9.2(E) U1.12(VSSA)
GND: C1.1 C2.1 C4.2 C5.1 C6.1 C7.1 C8.2 C9.1 C16.1 C19.1 C21.1 C22.1 C25.1 C26.1 C27.1 C34.1 C35.1 C36.2 C37.2 C38.2 C39.2 C41.1 C42.1 C43.1 C44.1 C45.1 C46.1 C47.1 C48.1 C49.1 C50.1 C51.2 C55.1 C56.1 C57.1 C58.2 CN1.4 D1.2(A) D2.1 D3.1 D4.2 Dz1.2(A) IC1.5(FB) IC1.7(GND) IC1.9(EP) IC2.2(GND) IC3.55(EN_BUCK) IC3.57(GND) IC4.2(GND) IC5.2(GND) IC5.8(S) J2.1 J5.1 J6.1 J7.2 J10.2 J11.2 Q6.1(S) Q6.2(S) Q6.3(S) R4.1 R8.1 R11.1 R11.2 R12.1 R20.1 R21.1 R25.1 R28.2 R31.1 R34.1 S1.1 S2.1 S3.1 S4.1 SW1.2 U1.18(VSS) U1.70(VSS) X1.2(GND) X1.4(GND)
POWER_BUCK: C4.1 IC1.2(VIN) IC1.3(EN) L1.2
POWER_IN: C21.2 D2.2 J1.1 Q7.5(D) Q7.6(D) Q7.7(D) Q7.8(D) Q7.9(D) R24.2 R26.2  [also labelled POWER_ISO]
POWER_LOAD: C5.2 C8.1 C34.2 C35.2 C36.1 C37.1 C38.1 C39.1 IC3.29(PVDD1) L1.1 Q1.5(D) Q1.6(D) Q1.7(D) Q1.8(D) Q1.9(D) Q2.5(D) Q2.6(D) Q2.7(D) Q2.8(D) Q2.9(D) Q3.5(D) Q3.6(D) Q3.7(D) Q3.8(D) Q3.9(D) Q8.5(D) Q8.6(D) Q8.7(D) Q8.8(D) Q8.9(D) R1.2 R2.2 R3.2  [also labelled V_BRIDGE]
V_5V: C6.2 C7.2 C22.2 C48.2 C49.2 IC2.1(VIN) IC5.3(VCC) L2.2 R4.2 R19.2
VDD_SPI: C1.2 C2.2 C25.2 C26.2 C27.2 C42.2 C43.2 C44.2 C45.2 C46.2 C47.2 C50.2 CN1.1 D3.2 D4.1 IC3.49(VDD_SPI) IC5.5(VIO) L3.2 R9.2 R10.1 R27.2 R32.2 U1.1(VBAT) U1.19(VDD) U1.32(VDD) U1.48(VDD) U1.64(VDD)  [also labelled 3V3]
AH: IC3.17(INH_A) U1.41(PA8)
AL: IC3.18(INL_A) U1.34(PB13)
BH: IC3.19(INH_B) U1.42(PA9)
BL: IC3.20(INL_B) U1.35(PB14)
CAN_N: C52.1 D4.3 IC5.6(L) J4.1 R29.1
CAN_P: C52.2 D3.3 IC5.7(H) J3.1 R29.2
CH: IC3.21(INH_C) U1.43(PA10)
CL: IC3.22(INL_C) U1.36(PB15)
DC_CAL: IC3.12(DC_CAL) U1.11(PC3)
EN_GATE: IC3.16(EN_GATE) U1.10(PC2)
GH_A: IC3.47(GH_A) R5.1
GH_B: IC3.42(GH_B) R6.1
GH_C: IC3.37(GH_C) R7.1
GL_A: IC3.45(GL_A) R13.1
GL_B: IC3.40(GL_B) R14.1
GL_C: IC3.35(GL_C) R15.1
JTCK/SWCLK: CN1.3 R34.2 U1.49(PA14(JTCK-SWCLK))
JTMS/SWDIO: CN1.2 R32.1 U1.46(PA13(JTMS-SWDIO))
nSCS: IC3.8(nSCS) U1.20(PA4)
OSC_IN: C57.2 R30.2 U1.5(PH0-OSC_IN(PH0)) X1.3(OSC2)
OSC_OUT: C58.1 R30.1 U1.6(PH1-OSC_OUT(PH1)) X1.1(OSC1)
RESET: C51.1 R27.1 SW1.1 U1.7(NRST)
RX: IC5.4(RXD) U1.61(PB8)
S1_N: C28.2 IC3.33(SN1) J8.1
S1_P: C28.1 IC3.32(SP1) J10.1
S2_N: C29.2 IC3.31(SN2) J9.1
S2_P: C29.1 IC3.30(SP2) J11.1
SCLK: IC3.11(SCLK) U1.51(PC10)
SDI: IC3.9(SDI) U1.53(PC12)
SDO: IC3.10(SDO) U1.52(PC11)
SH_A: C10.1 C13.2 IC3.46(SH_A) MOTOR_U1.1 Q1.1(S) Q1.2(S) Q1.3(S) Q4.5(D) Q4.6(D) Q4.7(D) Q4.8(D) Q4.9(D) R16.2
SH_B: C11.1 C15.2 IC3.41(SH_B) MOTOR_V1.1 Q3.1(S) Q3.2(S) Q3.3(S) Q5.5(D) Q5.6(D) Q5.7(D) Q5.8(D) Q5.9(D) R17.2
SH_C: C12.1 C20.2 IC3.36(SH_C) MOTOR_W1.1 Q2.1(S) Q2.2(S) Q2.3(S) Q6.5(D) Q6.6(D) Q6.7(D) Q6.8(D) Q6.9(D) R18.2
SL_A: C17.1 IC3.44(SL_A) J8.2 Q4.1(S) Q4.2(S) Q4.3(S) R20.2
SL_B: C18.1 IC3.39(SL_B) J9.2 Q5.1(S) Q5.2(S) Q5.3(S) R21.2
SL_C: IC3.34(SL_C) J7.1
SO1: C32.2 R22.2 U1.14(PA0-WKUP(PA0))
SO2: C33.2 R23.2 U1.15(PA1)
TEMP: Q9.1(B) Q9.3(C) R33.1 U1.22(PA6)
TX: IC5.1(TXD) U1.62(PB9)
NetC3_1: C3.1 D1.1(C) IC1.8(SW) L2.1
NetC3_2: C3.2 IC1.1(BOOT)
NetC9_2: C9.2 IC1.6(SS_or_PGOOD)
NetC10_2: C10.2 R1.1
NetC11_2: C11.2 R2.1
NetC12_2: C12.2 R3.1
NetC13_1: C13.1 IC3.48(BST_A)
NetC14_1: C14.1 IC3.15(CP2)
NetC14_2: C14.2 IC3.14(CP1)
NetC15_1: C15.1 IC3.43(BST_B)
NetC16_2: C16.2 IC3.13(GVDD)
NetC17_2: C17.2 R16.1
NetC18_2: C18.2 R17.1
NetC19_2: C19.2 R18.1
NetC20_1: C20.1 IC3.38(BST_C)
NetC30_2: C30.2 IC3.23(DVDD)
NetC31_1: C31.1 IC3.27(AVDD)
NetC40_1: C40.1 IC4.4(VCAP)
NetC40_2: C40.2 C41.2 Dz1.1(K) IC4.1(EN/UVLO) IC4.5(VS) R26.1
NetC55_2: C55.2 U1.31(VCAP_1)
NetC56_2: C56.2 U1.47(VCAP_2)
NetIC1_4: IC1.4(RT/SYNC) R8.2
NetIC2_3: IC2.3(EN) R19.1
NetIC3_5: IC3.5(nOCTW) R10.2
NetIC3_6: IC3.6(nFAULT) R9.1
NetIC3_7: IC3.7(DTC) R12.2
NetIC3_25: IC3.25(SO1) R22.1
NetIC3_26: IC3.26(SO2) R23.1
NetIC4_6: IC4.6(GATE) Q7.4(G) Q8.4(G)
NetIC4_7: IC4.7(OV) R24.1 R25.2
NetIC4_8: IC4.8(SRC) Q7.1(S) Q7.2(S) Q7.3(S) Q8.1(S) Q8.2(S) Q8.3(S)
NetQ1_4: Q1.4(G) R5.2
NetQ2_4: Q2.4(G) R7.2
NetQ3_4: Q3.4(G) R6.2
NetQ4_4: Q4.4(G) R13.2
NetQ5_4: Q5.4(G) R14.2
NetQ6_4: Q6.4(G) R15.2
NetR28_1: R28.1 U1.28(PB2-BOOT1(PB2))
NetR31_2: R31.2 U1.60(BOOT0)

Not connected (* = marked no-connect by the designer): IC2 4(NC)*; IC3 1(RT_CLK)* 2(COMP)* 3(VSENSE)* 4(PWRGD)* 50(PH)* 51(PH)* 52(BST_BK)* 53(PVDD2)* 54(PVDD2)* 56(SS_TR)*; IC4 3(N.C)*; U1 2(PC13)* 3(PC14-OSC32_IN(PC14))* 4(PC15-OSC32_OUT(PC15))* 8(PC0)* 9(PC1)* 16(PA2)* 17(PA3)* 21(PA5)* 23(PA7)* 24(PC4)* 25(PC5)* 26(PB0)* 27(PB1)* 29(PB10)* 30(PB11)* 33(PB12)* 37(PC6)* 38(PC7)* 39(PC8)* 40(PC9)* 44(PA11)* 45(PA12)* 50(PA15(JTDI))* 54(PD2)* 55(PB3(JTDOTRACESWO))* 56(PB4(NJTRST))* 57(PB5)* 58(PB6)* 59(PB7)*

## Layout directives
net class CSAI: S1_N, S1_P, S2_N, S2_P
net class SPI3: nSCS, SCLK, SDI, SDO
net class TIME1: AH, AL, BH, BL, CH, CL, EN_GATE
differential pair; differential pair class DIFF: CAN_N, CAN_P, S1_N, S1_P, S2_N, S2_P

## Notes on the sheet
- (near J1) DC POWER INPUT&TVS PROTECTIONS
- LC LOW-PASS FILTER
- DC TO DC BUCK CONVERTER
- REVERSE POLARITY PROTECTION
- DC TO DC BUCK CONVERTER 5V TO 3V3
- CAP BANK
- Qg TYPE = 59 nC
  Rds(on) = 4mohm
  OC_ADJ_SET = 0.25V.
  Overcurrent Trip = OC_ADJ_SET/Rdss = 60A
  Gain option 10V/V
  current shunt amplifiers to measure  = 50A.
  RSENSE = 3.3mohm
- DRIVER
- Dead time: khoảng thời gian trễ an toàn giữa quá trình tắt và bật mosfets.
  DT_min ~ (toff + tf) + margin.
- MCU
- Bypass & decoupling
- RESET
- CAN BUS
- (near U1) POWER MCU
- (near CN1) JTAG
- TEMPERATURE SENSOR
- (near C57) OSCILLATOR

## Library data of the parts
C1 C3 C24 C27 C44-C47 C49-C51 C54 = CC0603KRX7R9BB104: 100nF ±10% 50V Ceramic Capacitor X7R 0603
C2 C22 C23 C25 C42 C48 = CL10A106KP8NNNC: 10uF ±10% 10V Ceramic Capacitor X5R 0603
C4 = C3216X6S2A106KT0A0E: 10uF X6S ±10% 100V 1206 Ceramic Capacitors RoHS
C5 C13 C15 C20 C21 C34 = CL21B104KCFNNNE: 100nF ±10% 100V Ceramic Capacitor X7R 0805
C6 C7 = GRM21BR61A476ME15L_1: 47uF ±20% 10V Ceramic Capacitor X5R 0805
C8 C36-C39 = EFVH100ADA101M10C0: 100uF ±20% 100V Aluminum Electrolytic Capacitors
C9 = GRM3195C1H163JA01D: 16nF ±5% 50V Ceramic Capacitor C0G 1206
C10-C12 C17-C19 = CC0805KRX7R0BB103: 10nF ±10% 100V Ceramic Capacitor X7R 0805
C14 = CC0805KKX7R0BB224: 220nF ±10% 100V Ceramic Capacitor X7R 0805
C16 C32 C33 C55 C56 = CC0603X5R25V225KN: 2.2uF X5R ±10% 25V 0603 Ceramic Capacitors RoHS
C26 C30 C31 C43 C53 = CL10B105KA8NNNC: 1uF ±10% 25V Ceramic Capacitor X7R 0603
C28 C29 = CC0603KRX7R9BB102: 1nF ±10% 50V Ceramic Capacitor X7R 0603
C35 = CIA0805X5R475K101MT: 4.7uF ±10% 100V Ceramic Capacitor X5R 0805
C40 = CGA0603X7S224K101JT: 220nF ±10% 100V Ceramic Capacitor X7S 0603
C41 = GRM188D72A105KE01D: 1uF ±10% 100V Ceramic Capacitor X7T 0603
C52 = CL10C101JB8NNNC: 100pF ±5% 50V Ceramic Capacitor C0G 0603
C57 C58 = CL10C180JB8NNNC: 18pF ±5% 50V Ceramic Capacitor C0G 0603
CN1 = HX PH254-01-04-Z-L11.5 STRAIGHT PIN HEADER: Pin Header 1 2.5mm 6mm -40℃~+105℃ 3mm 4P 2.54mm 3A 1kV 1x4P Through Hole,P=2.54mm Headers, Male Pins RoHS
D1 = MBRS3100T3G: Diode 100V 3A Surface Mount DO-214AB
D2 = VISHAY SMCJ54A-E3/57T: 87.1VC Clamp 17.2A Ipp TVS DIODE DO-214AB(SMCJ)
D3 D4 = BAT54C_C916424: 600mA 30V 1 Pair Common Cathode 1V@100mA 200mA SOT-23 Single Diodes RoHS
Dz1 = BZT52C56: Zener Diode Independent 56V 500mW Surface Mount SOD-123W
IC1 = LMR16030SDDAR: 2.5MHz Buck Adjustable 800mV~50V 3A 4.3V~60V SO-8-EP Voltage Regulators - DC DC Switching Regulators RoHS
IC2 = SPX3819M5-L-3-3: 3.3V 16V Positive Fixed SOT-23-5 Voltage Regulators - Linear, Low Drop Out (LDO) Regulators RoHS
IC3 = DRV8301DCA: MOSFET 1.7A 2.3A HTSSOP-56-EP-6mm Motor Drivers, Controllers RoHS
IC4 = LM74502DDFR: Low-IQ high-side switch controller with reverse polarity protection and overvoltage protection functions
IC5 = TJA1051T/3/1J: 4.5V~5.5V CAN FD Transceiver SOIC-8-150mil Drivers, Receivers, Transceivers RoHS
J6-J11 = 2way: ComponentLink1URL: http://www.edatools.cz/addons; ComponentLink1Description: Source; FootprintNote: LP=12mil, MP=40mil, HP=120mil
L1 = SMDRI127-470MT: 2.5A 47uH 4.6A 100mΩ Magnetic Shielded Inductor ±20% SMD,12.3x12.3mm Fixed Inductors RoHS
L2 = FXL0630-8R2-M: 5A 8.2uH 6A 60mΩ Molded Inductor ±20% SMD,7x6.6mm Fixed Inductors RoHS
L3 = BLM21PG221SN1D: 220Ω@100MHz 1 Line Ferrite Bead 0805 2A 45mΩ
Q1-Q8 = TPH4R008NH,L1Q(M: N-Channel 80V 100A 78W SOP-8-Advance
Q9 = MMBT3904TT1G: Bipolar (BJT) Transistor NPN 40V 200mA 300MHz 200mW Surface Mount SOT-416
R1-R3 R16-R18 = CRCW080510R0FKEAHP: 10Ω 500mW Thick Film Resistor ±100ppm/℃ ±1% 0805 Chip Resistor - Surface Mount RoHS
R4 = RC0603FR-07100KL: 100mW 100kΩ 75V Thick Film Resistor ±100ppm/℃ ±1% 0603 Chip Resistor - Surface Mount RoHS
R5-R7 R13-R15 = FRC1206F8R06TS: 8.06Ω ±1% 250mW 1206 Thick Film Resistor
R8 = RC0603FR-0749K9L: 100mW 49.9kΩ 75V Thick Film Resistor ±100ppm/℃ ±1% 0603 Chip Resistor - Surface Mount RoHS
R9 R10 R19 R24-R28 R31 R32 R34 = RC0603FR-0710KL: 100mW 10kΩ 75V ±100ppm/℃ Thick Film Resistor ±1% 0603 Chip Resistor - Surface Mount ROHS
R11 = 0603WAF1782T5E: 17.8kΩ ±1% 100mW 0603 Thick Film Resistor
R12 = FRC0603F2492TS: 24.9kΩ ±1% 100mW 0603 Thick Film Resistor
R20 R21 = WSLP25123L300FEA: 3.3mΩ 3W Current Sense Resistor ±1% ±150ppm/℃ 2512 Chip Resistor - Surface Mount RoHS
R22 R23 = FRC0603F56R0TS: 56Ω ±1% 100mW 0603 Thick Film Resistor
R29 = 0603WAF1200T5E: 120Ω ±1% 100mW 0603 Thick Film Resistor
R30 = RC0603FR-071ML: 100mW 1MΩ 75V Thick Film Resistor ±100ppm/℃ ±1% 0603 Chip Resistor - Surface Mount RoHS
R33 = RC0603FR-0733KL: 100mW 33kΩ 75V Thick Film Resistor ±100ppm/℃ ±1% 0603 Chip Resistor - Surface Mount RoHS
SW1 = B3U-1000P: 12V 2.5mm Round Button 3mm SPST 50mA SMD,3x2.5mm Tactile Switches ROHS
U1 = STM32F405RGT6: ARM Cortex-M4 32 Bit 168MHz 51 LQFP-64(10x10) Microcontrollers RoHS
X1 = ABM3B-8.000MHZ-10-1-U-T: Crystal 8MHz ±10ppm 10pF 200Ω SMD5032-4P